# Altium project PCB_Project.PrjPcb
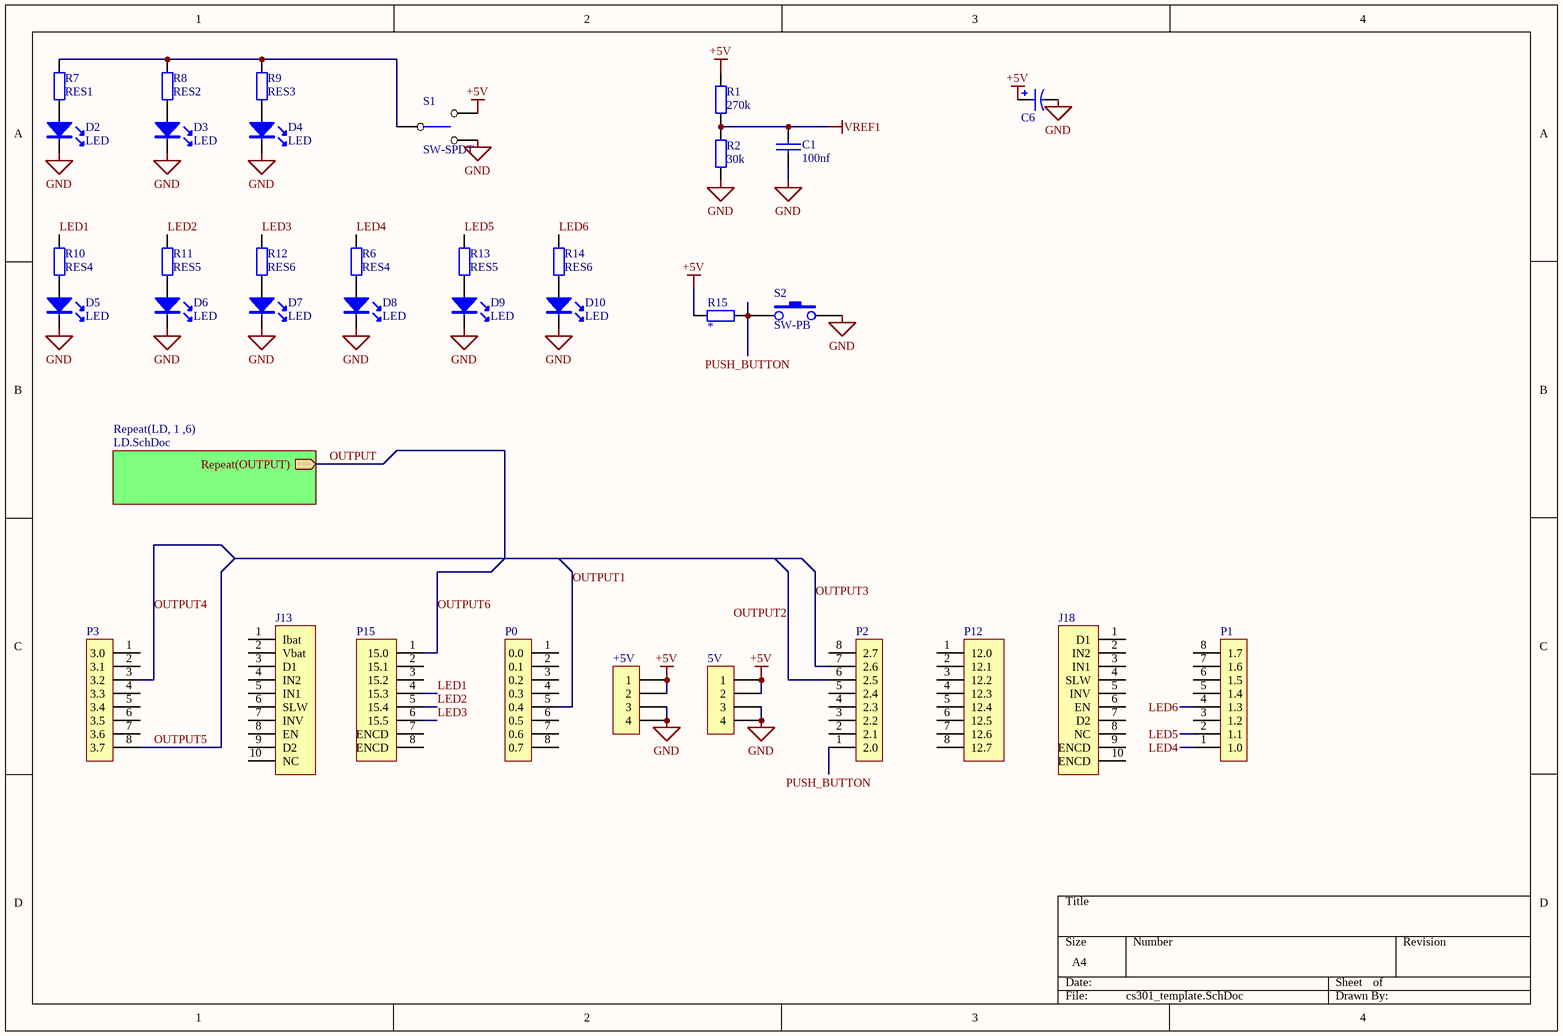
[diagram p0: cs301_template.SchDoc]
2 sheets, 101 parts. Net scope: hierarchical (ports join the sheet entries above them; power ports are global).
Board file: cs301_template.PcbDoc
Sheets:
  cs301_template.SchDoc
    LD1 = LD.SchDoc
    LD2 = LD.SchDoc
    LD3 = LD.SchDoc
    LD4 = LD.SchDoc
    LD5 = LD.SchDoc
    LD6 = LD.SchDoc

## Sheet cs301_template.SchDoc
size A4; SheetNumber: 1; SheetTotal: 2

### Parts
5V  5V  [IDC4]  (value not drawn)
+5V  5V  [IDC4]  (value not drawn)
C1  100nf  [0805 CAP]
C6  *  [CAP POL 8x5.4mm SMT]  (value not drawn)
D2  LED  [LED0.1/5MM]
D3  LED  [LED0.1/5MM]
D4  LED  [LED0.1/5MM]
D5  LED  [LED0.1/5MM]
D6  LED  [LED0.1/5MM]
D7  LED  [LED0.1/5MM]
D8  LED  [LED0.1/5MM]
D9  LED  [LED0.1/5MM]
D10  LED  [LED0.1/5MM]
J13  CON10  [idc10]  (value not drawn)
J18  CON10  [IDC10]  (value not drawn)
P0  P0  [idc8]  (value not drawn)
P1  P1  [idc8]  (value not drawn)
P2  P2  [idc8]  (value not drawn)
P3  P3  [idc8]  (value not drawn)
P12  P12  [idc8]  (value not drawn)
P15  P15  [idc8]  (value not drawn)
R1  270k  [0805 RES]
R2  30k  [0805 RES]
R6  RES4  [0805 RES]
R7  RES1  [0805 RES]
R8  RES2  [0805 RES]
R9  RES3  [0805 RES]
R10  RES4  [0805 RES]
R11  RES5  [0805 RES]
R12  RES6  [0805 RES]
R13  RES5  [0805 RES]
R14  RES6  [0805 RES]
R15  *  [0805 RES]
S1  SW-SPDT  [SW-SPDT]
S2  SW-PB  [SW-PB]

### Sub-sheets
Repeat(LD, 1 ,6) = LD.SchDoc: Repeat(OUTPUT) (out)

### Nets
+5V: 5V.1 5V.2 +5V.1 +5V.2 C6.1 R1.2 R15.1 S1.1
GND: 5V.3 5V.4 +5V.3 +5V.4 C1.2 C6.2 D2.K D3.K D4.K D5.K D6.K D7.K D8.K D9.K D10.K R2.1 S1.3 S2.2
VREF1: C1.1 R1.1 R2.2
LED1: P15.4(15.3) R10.2
LED2: P15.5(15.4) R11.2
LED3: P15.6(15.5) R12.2
LED4: P1.1(1.0) R6.2
LED5: P1.2(1.1) R13.2
LED6: P1.4(1.3) R14.2
OUTPUT: sheet Repeat(LD, 1 ,6)/Repeat(OUTPUT)
OUTPUT1: P0.5(0.4)
OUTPUT2: P2.6(2.5)
OUTPUT3: P2.7(2.6)
OUTPUT4: P3.3(3.2)
OUTPUT5: P3.8(3.7)
OUTPUT6: P15.1(15.0)
PUSH_BUTTON: P2.1(2.0) R15.2 S2.1
NetD2_A: D2.A R7.1
NetD3_A: D3.A R8.1
NetD4_A: D4.A R9.1
NetD5_A: D5.A R10.1
NetD6_A: D6.A R11.1
NetD7_A: D7.A R12.1
NetD8_A: D8.A R6.1
NetD9_A: D9.A R13.1
NetD10_A: D10.A R14.1
NetR7_2: R7.2 R8.2 R9.2 S1.2

Not connected (* = marked no-connect by the designer): J13 1(Ibat) 2(Vbat) 3(D1) 4(IN2) 5(IN1) 6(SLW) 7(INV) 8(EN) 9(D2) 10(NC); J18 1(D1) 2(IN2) 3(IN1) 4(SLW) 5(INV) 6(EN) 7(D2) 8(NC) 9(ENCD) 10(ENCD); P0 1(0.0) 2(0.1) 3(0.2) 4(0.3) 6(0.5) 7(0.6) 8(0.7); P1 3(1.2) 5(1.4) 6(1.5) 7(1.6) 8(1.7); P2 2(2.1) 3(2.2) 4(2.3) 5(2.4) 8(2.7); P3 1(3.0) 2(3.1) 4(3.3) 5(3.4) 6(3.5) 7(3.6); P12 1(12.0) 2(12.1) 3(12.2) 4(12.3) 5(12.4) 6(12.5) 7(12.6) 8(12.7); P15 2(15.1) 3(15.2) 7(ENCD) 8(ENCD)

### Buses and harness runs
bus 

### Library data of the parts
5V +5V = CON4: Connector
C1 = CerCap_SMT_0805: SMT ceramic capacitor 0805 size; Value: *
C6 = ElecCap_SMT_8D0: CAP ALUM 22UF 20% 50V SMD (Model: UWX1H220MCL1GB); Manufacturer: Nichicon; Manufacturer Part Number: UWX1V220MCL1GB; Lifetime @ Temp.: 2000 Hrs @ 85°C; Polarization: Polar; Surface Mount Land Size: 0.260" L x 0.260" W (6.60mm x 6.60mm); Capacitance 1: 22 µF; Revision: July-2002: Re-released for DXP Platform.; RoHS: RoHS Compliant; Category: Capacitors; Stock 1: 680; Pricing 1: 1=0.59, 10=0.406, 100=0.2304, 500=0.16268 (NZD); Packaging: Cut Tape (CT); Part Status: Active; Tolerance: ±20%; ESR (Equivalent Series Resistance): -; Operating Temperature: -40°C ~ 85°C; Ratings: -; Applications: General Purpose; Lead Spacing: -; Size / Dimension: 0.248" Dia (6.30mm); Height - Seated (Max): 0.213" (5.40mm); Mounting Type: Surface Mount; Package / Case: Radial, Can - SMD; ComponentLink1URL: http://nichicon-us.com/english/products/pdfs/e-uwx.pdf; ComponentLink1Description: http://nichicon-us.com/english/products/pdfs/e-uwx.pdf; Supplier 1: Digi-Key; Supplier Part Number 1: 493-2136-1-ND; Value: *
J13 J18 = CON10: Connector
P0-P3 = CON8: Connector
P12 P15 = CON8_1: Connector
R1 R2 R6-R15 = Res_SMT_0805: 0805 resistor; Published: 8-Jun-2000; LatestRevisionDate: 17-Jul-2002; LatestRevisionNote: Re-released for DXP Platform.; PackageReference: AXIAL-0.4; Publisher: Altium Limited; Value: *; ComponentLink1Description: https://nz.mouser.com/datasheet/2/315/AOA0000C304-1149620.pdf
S1 = SW-SPDT: Toggle Switch
S2 = SW-PB: Push Button Switch

## Sheet LD.SchDoc
size A4; SheetNumber: 2; SheetTotal: 2
Used 6 times, as channels LD1, LD2, LD3, LD4, LD5, LD6. Parts and nets are listed once, with the designators drawn on the sheet.
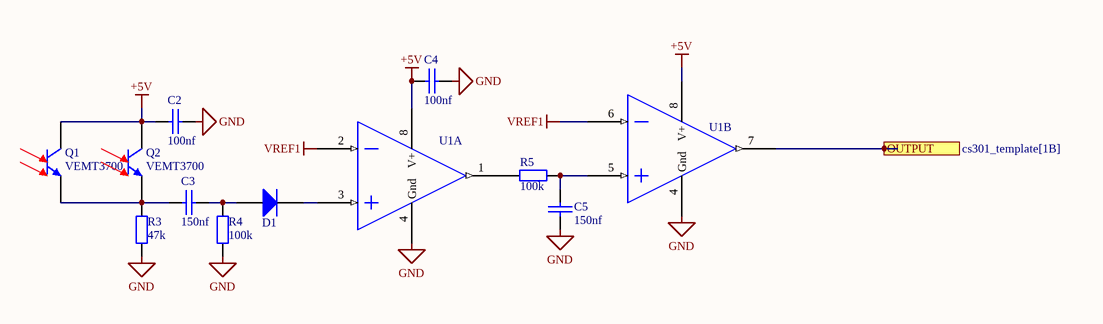
[diagram p1: LD.SchDoc]

### Parts
C2  100nf  [0805 CAP]
C3  150nf  [0805 CAP]
C4  100nf  [0805 CAP]
C5  150nf  [0805 CAP]
D1  (no value)  [ECE-DIO10.46-5.3x2.8TH]
Q1  VEMT3700  [0805 LED]
Q2  VEMT3700  [0805 LED]
R3  47k  [0805 RES]
R4  100k  [0805 RES]
R5  100k  [0805 RES]
U1  TLC082  [ECE-SOIC8]  (value not drawn)  (parts A,B of 2)

### Ports
OUTPUT (out, see cs301_template[1B])

### Nets
+5V: C2.1 C4.1 Q1.1(C) Q2.1(C) U1.8(V+)
GND: C2.2 C4.2 C5.2 R3.1 R4.1 U1.4(Gnd)
VREF1: U1.2(IN1(-)) U1.6(IN2(-))
OUTPUT: U1.7(OUT2) ; port OUTPUT
NetC3_1: C3.1 Q1.2(E) Q2.2(E) R3.2
NetC3_2: C3.2 D1.1(A) R4.2
NetC5_1: C5.1 R5.2 U1.5(IN2(+))
NetD1_2: D1.2(K) U1.3(IN1(+))
NetR5_1: R5.1 U1.1(OUT1)

### Channels
LD1: designators end in _LD1; ports OUTPUT=OUTPUT1
LD2: designators end in _LD2; ports OUTPUT=OUTPUT2
LD3: designators end in _LD3; ports OUTPUT=OUTPUT3
LD4: designators end in _LD4; ports OUTPUT=OUTPUT4
LD5: designators end in _LD5; ports OUTPUT=OUTPUT5
LD6: designators end in _LD6; ports OUTPUT=OUTPUT6

### Library data of the parts
C2-C5 = CerCap_SMT_0805: SMT ceramic capacitor 0805 size; Value: *
D1 = DIO000006: Schottky Small Signal Diode 200mA 30V TH; Manufactuer: NXP; Value: BAT85; Assembly Method: Through hole; Voltage/Current: 200mA-30V; Item Type: Item; Path: ece/ts/Lists/Stock Inventory; UoA Stock#: DIO000006; Size/Package: Axial; Manufacturer-PN: BAT85; Datasheet Link: http://share.engineering.auckland.ac.nz/ece/ts/Student%20Documents/BAT85_diode.pdf; Supplier1: Element14; Supplier1-PN: 1097299; Category: Diode; Status: Active
Q1 Q2 = VEMT3700: Silicon NPN Phototransistor
R3-R5 = Res_SMT_0805: 0805 resistor; Published: 8-Jun-2000; LatestRevisionDate: 17-Jul-2002; LatestRevisionNote: Re-released for DXP Platform.; PackageReference: AXIAL-0.4; Publisher: Altium Limited; Value: *; ComponentLink1Description: https://nz.mouser.com/datasheet/2/315/AOA0000C304-1149620.pdf
U1 = OPA000103: IC OPAMP TLC082 GP 10MHZ 8SOIC; Manufactuer: Texas Instruments; Manufacturer-PN: TLC082IDR; Assembly Method: Surface Mount; Item Type: Item; Path: ece/ts/Lists/Stock Inventory; UoA Stock#: OPA000103; Value: TLC082; Size/Package: SOIC 8; Datasheet Link: http://share.engineering.auckland.ac.nz/ece/ts/Student%20Documents/TLC082.pdf; Supplier1: Digikey; Supplier1-PN: 296-7271-6-ND; Component Type: SOIC18-TLC082; Category: OpAmp; Status: Active

## Nets that join several sheets
+5V: cs301_template (8 pins), LD1 (5 pins), LD2 (5 pins), LD3 (5 pins), LD4 (5 pins), LD5 (5 pins), LD6 (5 pins)
GND: cs301_template (18 pins), LD1 (6 pins), LD2 (6 pins), LD3 (6 pins), LD4 (6 pins), LD5 (6 pins), LD6 (6 pins)
VREF1: cs301_template (C1.1 R1.1 R2.2), LD1 (U1_LD1.2 U1_LD1.6), LD2 (U1_LD2.2 U1_LD2.6), LD3 (U1_LD3.2 U1_LD3.6), LD4 (U1_LD4.2 U1_LD4.6), LD5 (U1_LD5.2 U1_LD5.6), LD6 (U1_LD6.2 U1_LD6.6)
OUTPUT1: cs301_template (P0.5), LD1 (U1_LD1.7)
OUTPUT2: cs301_template (P2.6), LD2 (U1_LD2.7)
OUTPUT3: cs301_template (P2.7), LD3 (U1_LD3.7)
OUTPUT4: cs301_template (P3.3), LD4 (U1_LD4.7)
OUTPUT5: cs301_template (P3.8), LD5 (U1_LD5.7)
OUTPUT6: cs301_template (P15.1), LD6 (U1_LD6.7)